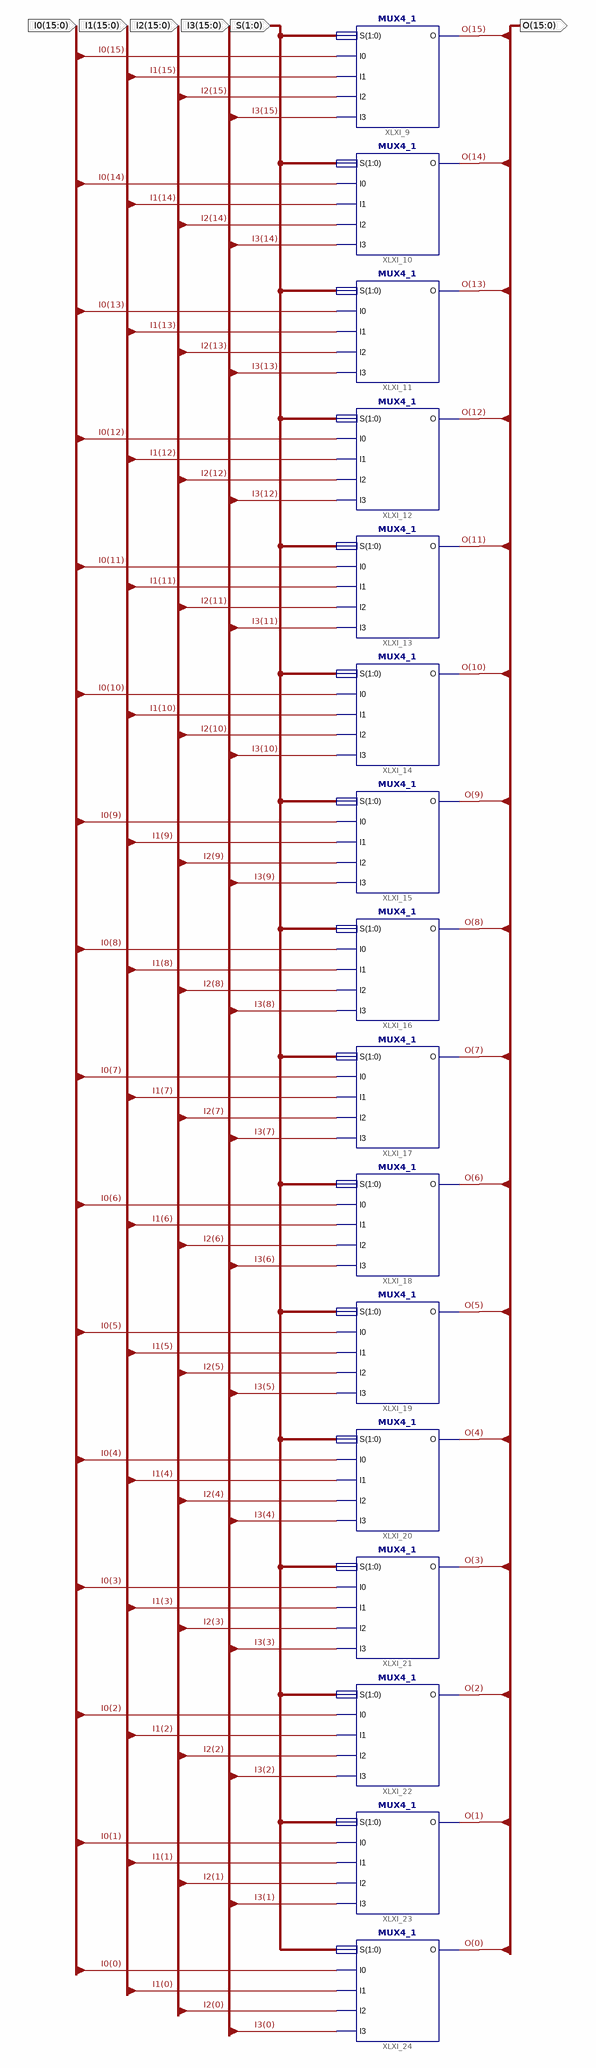
[diagram p0: schematic sheet 1]
// Xilinx ISE schematic MUX4_1_16bits.sch (virtex6) as structural Verilog: 16 symbols, 6 ports
module MUX4_1_16bits (
  input  [15:0] I0,
  input  [15:0] I1,
  input  [15:0] I2,
  input  [15:0] I3,
  input  [1:0] S,
  output [15:0] O
);

  MUX4_1 XLXI_9 (.I0(I0[15]), .I1(I1[15]), .I2(I2[15]), .I3(I3[15]), .O(O[15]), .S(S));
  MUX4_1 XLXI_10 (.I0(I0[14]), .I1(I1[14]), .I2(I2[14]), .I3(I3[14]), .O(O[14]), .S(S));
  MUX4_1 XLXI_11 (.I0(I0[13]), .I1(I1[13]), .I2(I2[13]), .I3(I3[13]), .O(O[13]), .S(S));
  MUX4_1 XLXI_12 (.I0(I0[12]), .I1(I1[12]), .I2(I2[12]), .I3(I3[12]), .O(O[12]), .S(S));
  MUX4_1 XLXI_13 (.I0(I0[11]), .I1(I1[11]), .I2(I2[11]), .I3(I3[11]), .O(O[11]), .S(S));
  MUX4_1 XLXI_14 (.I0(I0[10]), .I1(I1[10]), .I2(I2[10]), .I3(I3[10]), .O(O[10]), .S(S));
  MUX4_1 XLXI_15 (.I0(I0[9]), .I1(I1[9]), .I2(I2[9]), .I3(I3[9]), .O(O[9]), .S(S));
  MUX4_1 XLXI_16 (.I0(I0[8]), .I1(I1[8]), .I2(I2[8]), .I3(I3[8]), .O(O[8]), .S(S));
  MUX4_1 XLXI_17 (.I0(I0[7]), .I1(I1[7]), .I2(I2[7]), .I3(I3[7]), .O(O[7]), .S(S));
  MUX4_1 XLXI_18 (.I0(I0[6]), .I1(I1[6]), .I2(I2[6]), .I3(I3[6]), .O(O[6]), .S(S));
  MUX4_1 XLXI_19 (.I0(I0[5]), .I1(I1[5]), .I2(I2[5]), .I3(I3[5]), .O(O[5]), .S(S));
  MUX4_1 XLXI_20 (.I0(I0[4]), .I1(I1[4]), .I2(I2[4]), .I3(I3[4]), .O(O[4]), .S(S));
  MUX4_1 XLXI_21 (.I0(I0[3]), .I1(I1[3]), .I2(I2[3]), .I3(I3[3]), .O(O[3]), .S(S));
  MUX4_1 XLXI_22 (.I0(I0[2]), .I1(I1[2]), .I2(I2[2]), .I3(I3[2]), .O(O[2]), .S(S));
  MUX4_1 XLXI_23 (.I0(I0[1]), .I1(I1[1]), .I2(I2[1]), .I3(I3[1]), .O(O[1]), .S(S));
  MUX4_1 XLXI_24 (.I0(I0[0]), .I1(I1[0]), .I2(I2[0]), .I3(I3[0]), .O(O[0]), .S(S));
endmodule
